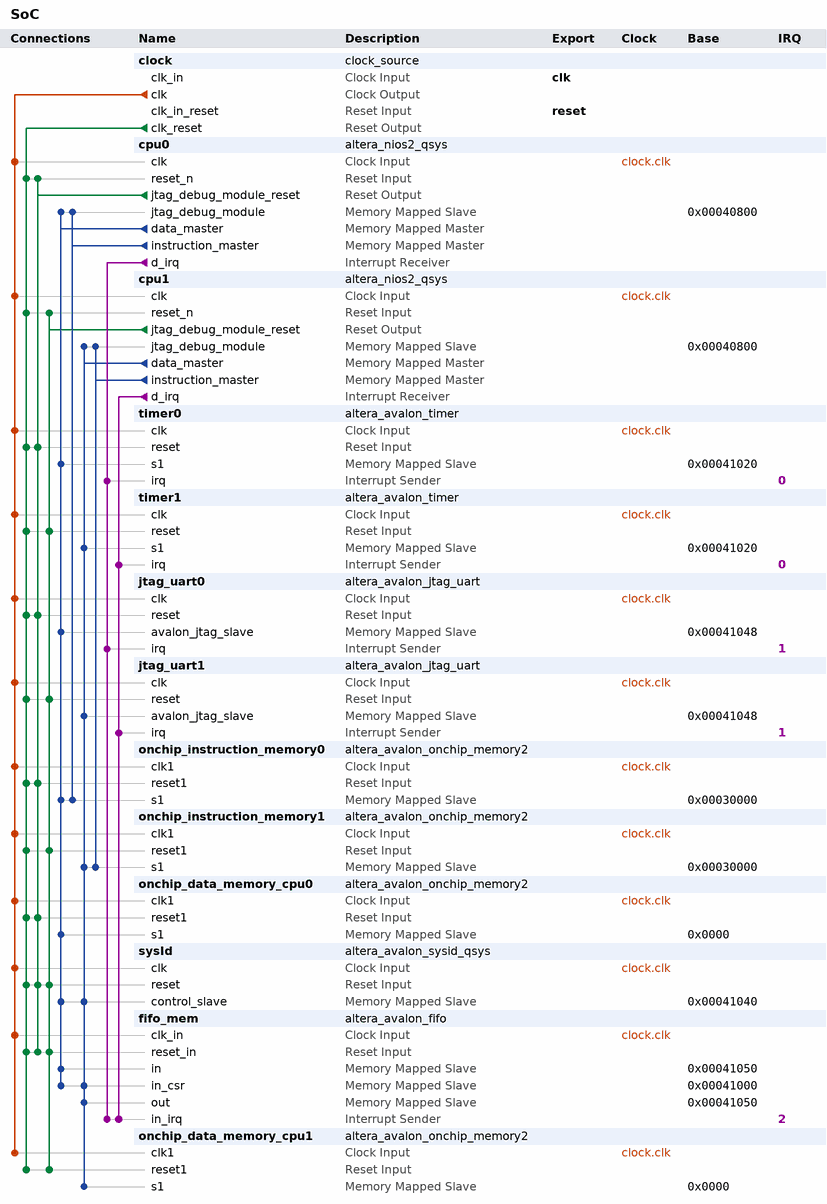
[diagram p0: system contents]
# Platform Designer (Qsys) system SoC, Cyclone IV E EP4CE115F29C7
# Parameters at their usual value, and those the tool derives, are not listed.
package require -exact qsys 13.1
create_system SoC
set_project_property DEVICE_FAMILY {Cyclone IV E}
set_project_property DEVICE EP4CE115F29C7

add_instance clock clock_source 13.1
set_instance_parameter_value clock clockFrequency 50000000

add_instance cpu0 altera_nios2_qsys 13.1
set_instance_parameter_value cpu0 resetSlave onchip_instruction_memory0.s1
set_instance_parameter_value cpu0 mmu_TLBMissExcSlave None
set_instance_parameter_value cpu0 exceptionSlave onchip_instruction_memory0.s1
set_instance_parameter_value cpu0 breakSlave cpu0.jtag_debug_module
set_instance_parameter_value cpu0 impl Tiny
set_instance_parameter_value cpu0 icache_size 4096

add_instance cpu1 altera_nios2_qsys 13.1
set_instance_parameter_value cpu1 resetSlave onchip_instruction_memory1.s1
set_instance_parameter_value cpu1 mmu_TLBMissExcSlave None
set_instance_parameter_value cpu1 exceptionSlave onchip_instruction_memory1.s1
set_instance_parameter_value cpu1 breakSlave cpu1.jtag_debug_module
set_instance_parameter_value cpu1 impl Tiny
set_instance_parameter_value cpu1 icache_size 4096

add_instance timer0 altera_avalon_timer 13.1
set_instance_parameter_value timer0 period 1
set_instance_parameter_value timer0 periodUnits MSEC

add_instance timer1 altera_avalon_timer 13.1
set_instance_parameter_value timer1 period 1
set_instance_parameter_value timer1 periodUnits MSEC

add_instance jtag_uart0 altera_avalon_jtag_uart 13.1
set_instance_parameter_value jtag_uart0 simInteractiveOptions NO_INTERACTIVE_WINDOWS

add_instance jtag_uart1 altera_avalon_jtag_uart 13.1
set_instance_parameter_value jtag_uart1 simInteractiveOptions NO_INTERACTIVE_WINDOWS

add_instance onchip_instruction_memory0 altera_avalon_onchip_memory2 13.1
set_instance_parameter_value onchip_instruction_memory0 dataWidth 32
set_instance_parameter_value onchip_instruction_memory0 dualPort false
set_instance_parameter_value onchip_instruction_memory0 initMemContent true
set_instance_parameter_value onchip_instruction_memory0 initializationFileName onchip_mem.hex
set_instance_parameter_value onchip_instruction_memory0 memorySize 65536

add_instance onchip_instruction_memory1 altera_avalon_onchip_memory2 13.1
set_instance_parameter_value onchip_instruction_memory1 dataWidth 32
set_instance_parameter_value onchip_instruction_memory1 dualPort false
set_instance_parameter_value onchip_instruction_memory1 initMemContent true
set_instance_parameter_value onchip_instruction_memory1 initializationFileName onchip_mem.hex
set_instance_parameter_value onchip_instruction_memory1 memorySize 65536

add_instance onchip_data_memory_cpu0 altera_avalon_onchip_memory2 13.1
set_instance_parameter_value onchip_data_memory_cpu0 dataWidth 32
set_instance_parameter_value onchip_data_memory_cpu0 dualPort false
set_instance_parameter_value onchip_data_memory_cpu0 initMemContent true
set_instance_parameter_value onchip_data_memory_cpu0 initializationFileName onchip_mem.hex
set_instance_parameter_value onchip_data_memory_cpu0 memorySize 131072

add_instance sysId altera_avalon_sysid_qsys 13.1
set_instance_parameter_value sysId id 0

add_instance fifo_mem altera_avalon_fifo 13.1
set_instance_parameter_value fifo_mem bitsPerSymbol 16
set_instance_parameter_value fifo_mem channelWidth 8
set_instance_parameter_value fifo_mem errorWidth 8
set_instance_parameter_value fifo_mem fifoDepth 16
set_instance_parameter_value fifo_mem fifoInputInterfaceOptions AVALONMM_WRITE
set_instance_parameter_value fifo_mem fifoOutputInterfaceOptions AVALONMM_READ
set_instance_parameter_value fifo_mem singleClockMode true
set_instance_parameter_value fifo_mem symbolsPerBeat 2
set_instance_parameter_value fifo_mem useIRQ true
set_instance_parameter_value fifo_mem usePacket true
set_instance_parameter_value fifo_mem useReadControl false

add_instance onchip_data_memory_cpu1 altera_avalon_onchip_memory2 13.1
set_instance_parameter_value onchip_data_memory_cpu1 dataWidth 32
set_instance_parameter_value onchip_data_memory_cpu1 dualPort false
set_instance_parameter_value onchip_data_memory_cpu1 initMemContent true
set_instance_parameter_value onchip_data_memory_cpu1 initializationFileName onchip_mem.hex
set_instance_parameter_value onchip_data_memory_cpu1 memorySize 131072

# connections
add_connection clock.clk cpu0.clk clock
add_connection clock.clk cpu1.clk clock
add_connection clock.clk fifo_mem.clk_in clock
add_connection clock.clk jtag_uart0.clk clock
add_connection clock.clk jtag_uart1.clk clock
add_connection clock.clk onchip_data_memory_cpu0.clk1 clock
add_connection clock.clk onchip_data_memory_cpu1.clk1 clock
add_connection clock.clk onchip_instruction_memory0.clk1 clock
add_connection clock.clk onchip_instruction_memory1.clk1 clock
add_connection clock.clk sysId.clk clock
add_connection clock.clk timer0.clk clock
add_connection clock.clk timer1.clk clock
add_connection clock.clk_reset cpu0.reset_n reset
add_connection clock.clk_reset cpu1.reset_n reset
add_connection clock.clk_reset fifo_mem.reset_in reset
add_connection clock.clk_reset jtag_uart0.reset reset
add_connection clock.clk_reset jtag_uart1.reset reset
add_connection clock.clk_reset onchip_data_memory_cpu0.reset1 reset
add_connection clock.clk_reset onchip_data_memory_cpu1.reset1 reset
add_connection clock.clk_reset onchip_instruction_memory0.reset1 reset
add_connection clock.clk_reset onchip_instruction_memory1.reset1 reset
add_connection clock.clk_reset sysId.reset reset
add_connection clock.clk_reset timer0.reset reset
add_connection clock.clk_reset timer1.reset reset
add_connection cpu0.jtag_debug_module_reset cpu0.reset_n reset
add_connection cpu0.jtag_debug_module_reset fifo_mem.reset_in reset
add_connection cpu0.jtag_debug_module_reset jtag_uart0.reset reset
add_connection cpu0.jtag_debug_module_reset onchip_data_memory_cpu0.reset1 reset
add_connection cpu0.jtag_debug_module_reset onchip_instruction_memory0.reset1 reset
add_connection cpu0.jtag_debug_module_reset sysId.reset reset
add_connection cpu0.jtag_debug_module_reset timer0.reset reset
add_connection cpu1.jtag_debug_module_reset cpu1.reset_n reset
add_connection cpu1.jtag_debug_module_reset fifo_mem.reset_in reset
add_connection cpu1.jtag_debug_module_reset jtag_uart1.reset reset
add_connection cpu1.jtag_debug_module_reset onchip_data_memory_cpu1.reset1 reset
add_connection cpu1.jtag_debug_module_reset onchip_instruction_memory1.reset1 reset
add_connection cpu1.jtag_debug_module_reset sysId.reset reset
add_connection cpu1.jtag_debug_module_reset timer1.reset reset
add_connection cpu0.data_master cpu0.jtag_debug_module avalon
set_connection_parameter_value cpu0.data_master/cpu0.jtag_debug_module baseAddress 0x00040800
add_connection cpu0.data_master fifo_mem.in avalon
set_connection_parameter_value cpu0.data_master/fifo_mem.in baseAddress 0x00041050
add_connection cpu0.data_master fifo_mem.in_csr avalon
set_connection_parameter_value cpu0.data_master/fifo_mem.in_csr baseAddress 0x00041000
add_connection cpu0.data_master jtag_uart0.avalon_jtag_slave avalon
set_connection_parameter_value cpu0.data_master/jtag_uart0.avalon_jtag_slave baseAddress 0x00041048
add_connection cpu0.data_master onchip_data_memory_cpu0.s1 avalon
set_connection_parameter_value cpu0.data_master/onchip_data_memory_cpu0.s1 baseAddress 0x0000
add_connection cpu0.data_master onchip_instruction_memory0.s1 avalon
set_connection_parameter_value cpu0.data_master/onchip_instruction_memory0.s1 baseAddress 0x00030000
add_connection cpu0.data_master sysId.control_slave avalon
set_connection_parameter_value cpu0.data_master/sysId.control_slave baseAddress 0x00041040
add_connection cpu0.data_master timer0.s1 avalon
set_connection_parameter_value cpu0.data_master/timer0.s1 baseAddress 0x00041020
add_connection cpu0.instruction_master cpu0.jtag_debug_module avalon
set_connection_parameter_value cpu0.instruction_master/cpu0.jtag_debug_module baseAddress 0x00040800
add_connection cpu0.instruction_master onchip_instruction_memory0.s1 avalon
set_connection_parameter_value cpu0.instruction_master/onchip_instruction_memory0.s1 baseAddress 0x00030000
add_connection cpu1.data_master cpu1.jtag_debug_module avalon
set_connection_parameter_value cpu1.data_master/cpu1.jtag_debug_module baseAddress 0x00040800
add_connection cpu1.data_master fifo_mem.in_csr avalon
set_connection_parameter_value cpu1.data_master/fifo_mem.in_csr baseAddress 0x00041000
add_connection cpu1.data_master fifo_mem.out avalon
set_connection_parameter_value cpu1.data_master/fifo_mem.out baseAddress 0x00041050
add_connection cpu1.data_master jtag_uart1.avalon_jtag_slave avalon
set_connection_parameter_value cpu1.data_master/jtag_uart1.avalon_jtag_slave baseAddress 0x00041048
add_connection cpu1.data_master onchip_data_memory_cpu1.s1 avalon
set_connection_parameter_value cpu1.data_master/onchip_data_memory_cpu1.s1 baseAddress 0x0000
add_connection cpu1.data_master onchip_instruction_memory1.s1 avalon
set_connection_parameter_value cpu1.data_master/onchip_instruction_memory1.s1 baseAddress 0x00030000
add_connection cpu1.data_master sysId.control_slave avalon
set_connection_parameter_value cpu1.data_master/sysId.control_slave baseAddress 0x00041040
add_connection cpu1.data_master timer1.s1 avalon
set_connection_parameter_value cpu1.data_master/timer1.s1 baseAddress 0x00041020
add_connection cpu1.instruction_master cpu1.jtag_debug_module avalon
set_connection_parameter_value cpu1.instruction_master/cpu1.jtag_debug_module baseAddress 0x00040800
add_connection cpu1.instruction_master onchip_instruction_memory1.s1 avalon
set_connection_parameter_value cpu1.instruction_master/onchip_instruction_memory1.s1 baseAddress 0x00030000
add_connection cpu0.d_irq fifo_mem.in_irq interrupt
set_connection_parameter_value cpu0.d_irq/fifo_mem.in_irq irqNumber 2
add_connection cpu0.d_irq jtag_uart0.irq interrupt
set_connection_parameter_value cpu0.d_irq/jtag_uart0.irq irqNumber 1
add_connection cpu0.d_irq timer0.irq interrupt
set_connection_parameter_value cpu0.d_irq/timer0.irq irqNumber 0
add_connection cpu1.d_irq fifo_mem.in_irq interrupt
set_connection_parameter_value cpu1.d_irq/fifo_mem.in_irq irqNumber 2
add_connection cpu1.d_irq jtag_uart1.irq interrupt
set_connection_parameter_value cpu1.d_irq/jtag_uart1.irq irqNumber 1
add_connection cpu1.d_irq timer1.irq interrupt
set_connection_parameter_value cpu1.d_irq/timer1.irq irqNumber 0

# exported interfaces
add_interface clk clock sink
set_interface_property clk EXPORT_OF clock.clk_in
add_interface reset reset sink
set_interface_property reset EXPORT_OF clock.clk_in_reset

set_interconnect_requirement {$system} qsys_mm.clockCrossingAdapter HANDSHAKE
set_interconnect_requirement {$system} qsys_mm.maxAdditionalLatency 1
set_interconnect_requirement {$system} qsys_mm.insertDefaultSlave false

save_system SoC.qsys
